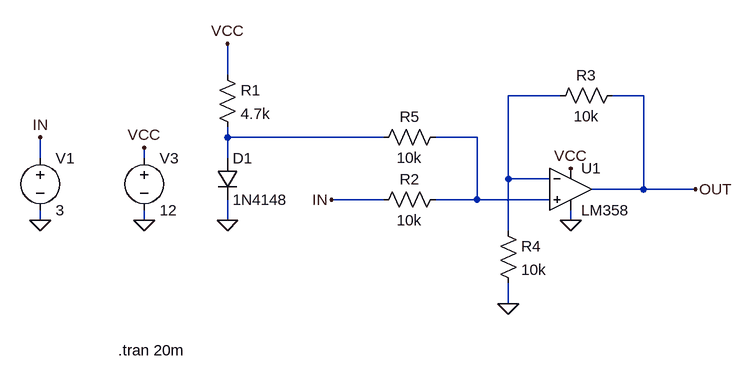
[diagram p0: schematic Draft2.asc]
Draft2.asc, the LTspice schematic file:
Version 4
SHEET 1 880 680
WIRE -352 0 -352 -48
WIRE 160 32 80 32
WIRE 288 32 240 32
WIRE -352 96 -352 80
WIRE -112 96 -352 96
WIRE 32 96 -32 96
WIRE -640 128 -640 96
WIRE -480 128 -480 112
WIRE -352 128 -352 96
WIRE 80 160 80 32
WIRE 144 160 80 160
WIRE 288 176 288 32
WIRE 288 176 208 176
WIRE 368 176 288 176
WIRE -112 192 -192 192
WIRE 32 192 32 96
WIRE 32 192 -32 192
WIRE 144 192 32 192
WIRE -640 224 -640 208
WIRE -480 224 -480 208
WIRE -352 224 -352 192
WIRE 176 224 176 208
WIRE 80 240 80 160
WIRE 80 352 80 320
FLAG -352 224 0
FLAG 176 224 0
FLAG -480 224 0
FLAG -480 112 VCC
FLAG 176 144 VCC
FLAG 368 176 OUT
FLAG -352 -48 VCC
FLAG 80 352 0
FLAG -192 192 IN
FLAG -640 224 0
FLAG -640 96 IN
SYMBOL OpAmps\\LM358 176 112 R0
SYMATTR InstName U1
SYMBOL voltage -480 112 R0
WINDOW 123 0 0 Left 0
WINDOW 39 0 0 Left 0
SYMATTR InstName V3
SYMATTR Value 12
SYMBOL res -16 176 R90
WINDOW 0 0 56 VBottom 2
WINDOW 3 32 56 VTop 2
SYMATTR InstName R2
SYMATTR Value 10k
SYMBOL res 256 16 R90
WINDOW 0 0 56 VBottom 2
WINDOW 3 32 56 VTop 2
SYMATTR InstName R3
SYMATTR Value 10k
SYMBOL res 64 224 R0
SYMATTR InstName R4
SYMATTR Value 10k
SYMBOL diode -368 128 R0
SYMATTR InstName D1
SYMATTR Value 1N4148
SYMBOL res -368 -16 R0
SYMATTR InstName R1
SYMATTR Value 4.7k
SYMBOL res -16 80 R90
WINDOW 0 0 56 VBottom 2
WINDOW 3 32 56 VTop 2
SYMATTR InstName R5
SYMATTR Value 10k
SYMBOL voltage -640 112 R0
WINDOW 123 0 0 Left 0
WINDOW 39 0 0 Left 0
SYMATTR InstName V1
SYMATTR Value 3
TEXT -520 424 Left 2 !.tran 20m

The netlist it stands for:
* Draft2.asc
XU1 N003 N001 VCC 0 OUT LM358  ; pins In+ In- V+ V- OUT
V3 VCC 0 12
R2 N003 IN 10k
R3 OUT N001 10k
R4 N001 0 10k
D1 N002 0 1N4148
R1 VCC N002 4.7k
R5 N003 N002 10k
V1 IN 0 3
.model D D
.lib standard.dio
.tran 20m
.backanno
.end